# EAGLE schematic fabpdi-t90usb_v1.1 (EAGLE 8.2.2)
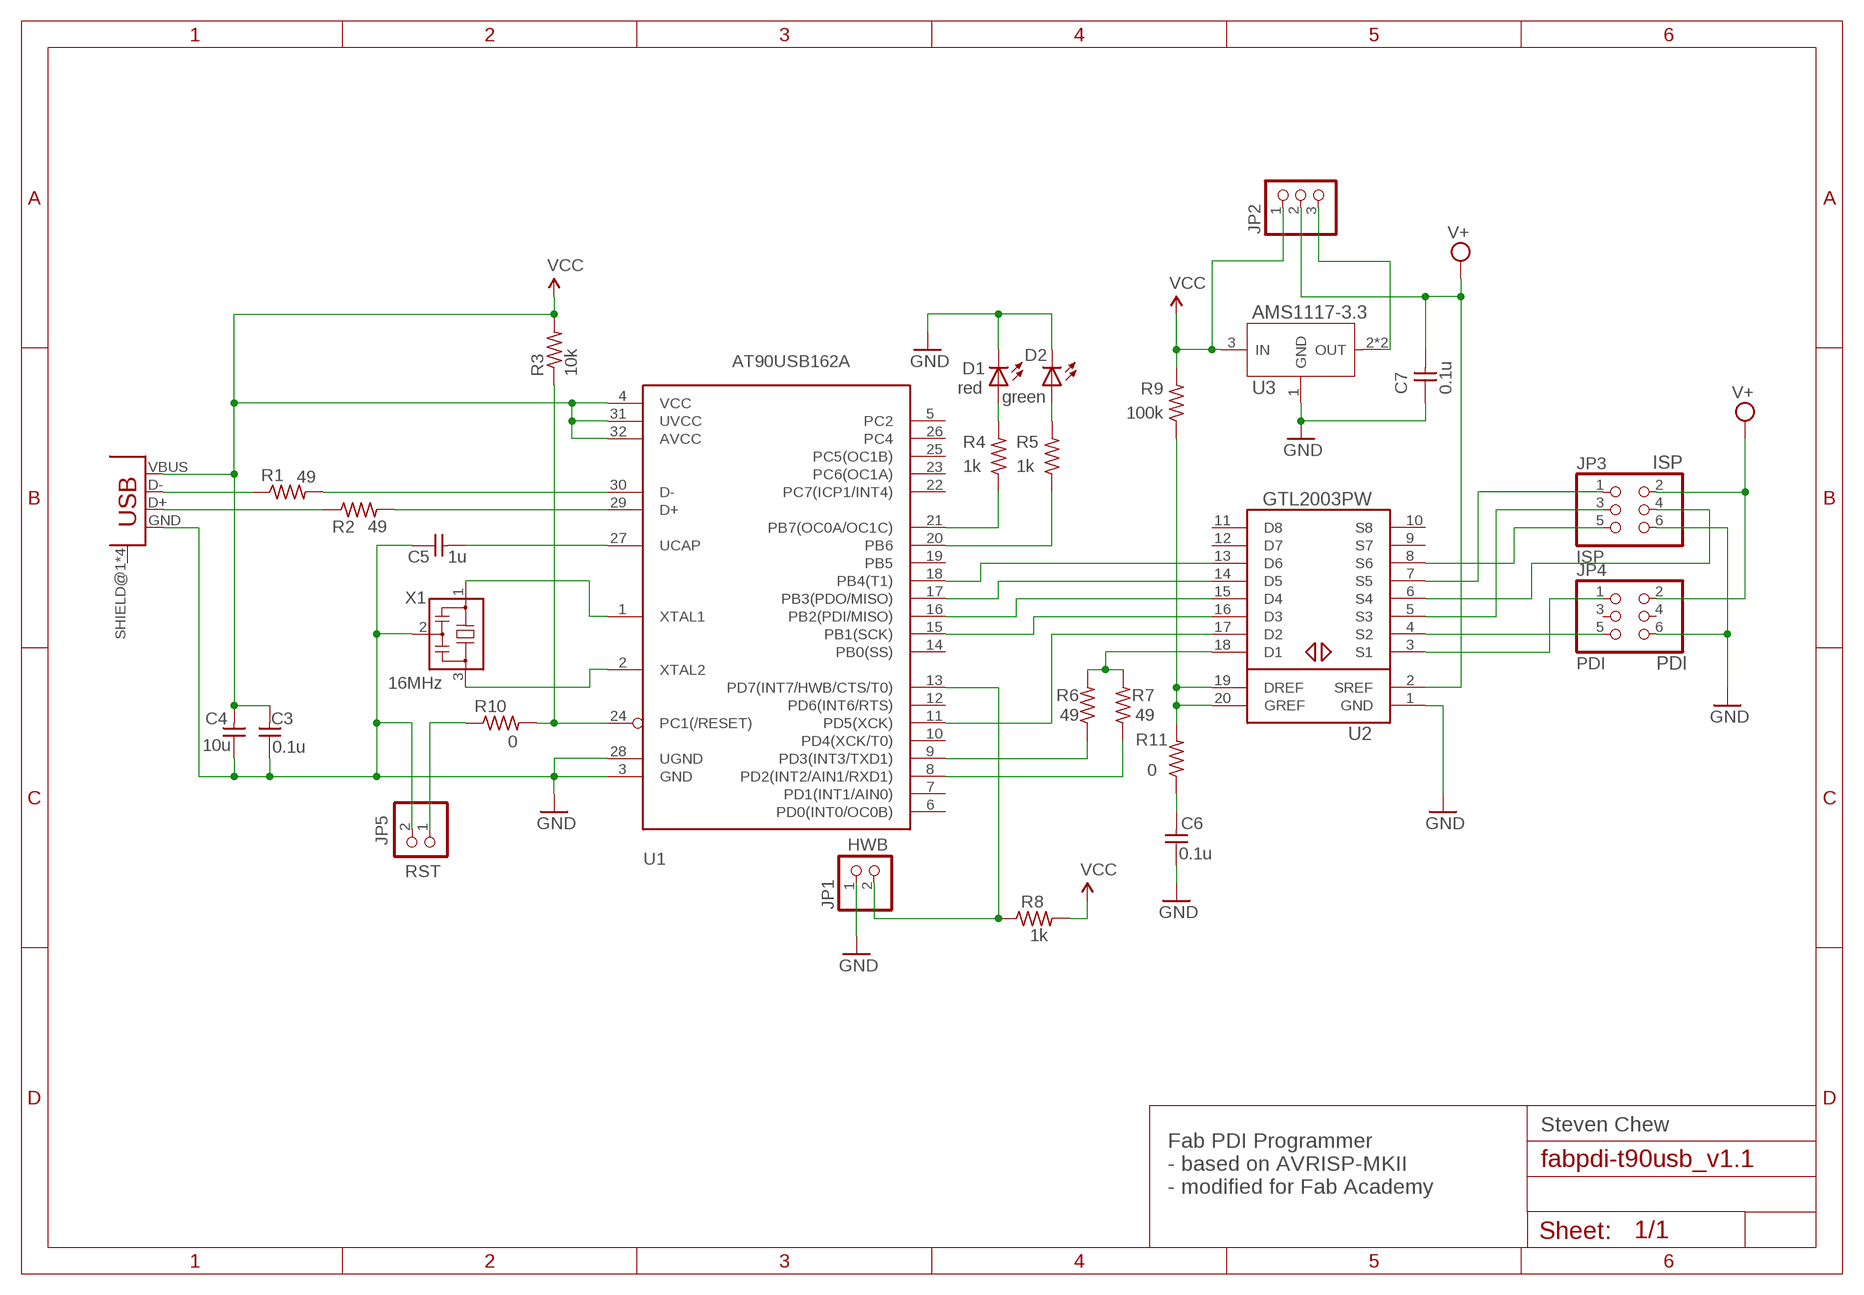
[diagram p0: schematic, sheet 1]

## Parts
C3  0.1u  CAP-UNPOLARIZEDFAB  [C1206FAB]
C4  10u  CAP-UNPOLARIZEDFAB  [C1206FAB]
C5  1u  CAP-UNPOLARIZEDFAB  [C1206FAB]
C6  0.1u  CAP-UNPOLARIZEDFAB  [C1206FAB]
C7  0.1u  CAP-UNPOLARIZEDFAB  [C1206FAB]
D1  red  LEDFAB1206  [LED1206FAB]
D2  green  LEDFAB1206  [LED1206FAB]
JP1  PINHD-1X2  [1X02]
JP2  PINHD-1X3  [1X03]
JP3  ISP  PINHD-2X3-SMDFAB  [2X03SMD-FAB]
JP4  PDI  PINHD-2X3-SMDFAB  [2X03SMD-FAB]
JP5  PINHD-1X2  [1X02]
R1  49  RES-US1206FAB  [R1206FAB]
R2  49  RES-US1206FAB  [R1206FAB]
R3  10k  RES-US1206FAB  [R1206FAB]
R4  1k  RES-US1206FAB  [R1206FAB]
R5  1k  RES-US1206FAB  [R1206FAB]
R6  49  RES-US1206FAB  [R1206FAB]
R7  49  RES-US1206FAB  [R1206FAB]
R8  1k  RES-US1206FAB  [R1206FAB]
R9  100k  RES-US1206FAB  [R1206FAB]
R10  0  RES-US1206FAB  [R1206FAB]
R11  0  RES-US1206FAB  [R1206FAB]
U1  AT90USB162A  [TQFP32-08]
U2  GTL2003PW  [TSSOP20]
U3  AMS1117-3.3  PMIC-CJT1117-3.3(SOT223)  [SOT-223]
U$1  USB_MINI  [USB_MINI]
X1  16MHz  RESONATOR  [EFOBM]

## Nets
GND: C3.1 C4.1 C5.1 C6.1 C7.1 D1.2(C) D2.2(C) JP1.1 JP3.6 JP4.6 JP5.2 U1.3(GND) U1.28(UGND) U2.1(GND) U3.1(GND) U$1.GND X1.2
N$1: R4.1 U1.21(PB7(OC0A/OC1C))
N$2: C5.2 U1.27(UCAP)
N$3: U1.1(XTAL1) X1.1
N$4: U1.2(XTAL2) X1.3
N$5: R2.1 U$1.D+
N$6: R2.2 U1.29(D+)
N$7: R1.1 U$1.D-
N$8: R1.2 U1.30(D-)
N$9: R3.1 R10.2 U1.24(PC1(/RESET))
N$10: R5.1 U1.20(PB6)
N$11: D1.1(A) R4.2
N$12: D2.1(A) R5.2
N$13: U1.11(PD5(XCK)) U2.17(D2)
N$14: R6.1 U1.9(PD3(INT3/TXD1))
N$15: R7.1 U1.8(PD2(INT2/AIN1/RXD1))
N$16: JP1.2 R8.1 U1.13(PD7(INT7/HWB/CTS/T0))
N$17: R6.2 R7.2 U2.18(D1)
N$18: U1.15(PB1(SCK)) U2.16(D3)
N$19: U1.16(PB2(PDI/MISO)) U2.15(D4)
N$20: U1.17(PB3(PDO/MISO)) U2.14(D5)
N$21: U1.18(PB4(T1)) U2.13(D6)
N$22: R9.1 R11.2 U2.19(DREF) U2.20(GREF)
N$23: JP3.1 U2.7(S5)
N$24: JP2.3 U3.2(OUT) U3.TER(OUT)
N$25: JP3.3 U2.5(S3)
N$26: JP3.4 U2.6(S4)
N$27: JP3.5 U2.8(S6)
N$28: JP4.5 U2.4(S2)
N$29: JP4.1 U2.3(S1)
N$30: C6.2 R11.1
N$31: JP5.1 R10.1
V+: C7.2 JP2.2 JP3.2 JP4.2 U2.2(SREF)
VCC: C3.2 C4.2 JP2.1 R3.2 R8.2 R9.2 U1.4(VCC) U1.31(UVCC) U1.32(AVCC) U3.3(IN) U$1.VBUS
Unconnected: JP4.3 JP4.4 U1.5(PC2) U1.6(PD0(INT0/OC0B)) U1.7(PD1(INT1/AIN0)) U1.10(PD4(XCK/T0)) U1.12(PD6(INT6/RTS)) U1.14(PB0(SS)) U1.19(PB5) U1.22(PC7(ICP1/INT4)) U1.23(PC6(OC1A)) U1.25(PC5(OC1B)) U1.26(PC4) U2.9(S7) U2.10(S8) U2.11(D8) U2.12(D7) U$1.SHIELD@1(SHIELD) U$1.SHIELD@2(SHIELD) U$1.SHIELD@3(SHIELD) U$1.SHIELD@4(SHIELD)

## Notes on the sheet
- ISP
- PDI
- HWB
- RST
- Steven Chew
- Fab PDI Programmer
  - based on AVRISP-MKII
  - modified for Fab Academy

## Library data of the parts
C3-C7 = 00fab:CAP-UNPOLARIZED
D1 D2 = 00fab:LED: LED
JP1 JP5 = pinhead:PINHD-1X2: PIN HEADER
JP2 = pinhead:PINHD-1X3: PIN HEADER
JP3 JP4 = 00fab:PINHD-2X3-SMD: PIN HEADER
R1-R11 = 00fab:RES-US: Resistor (US Symbol) Variants with postfix FAB are widened to allow the routing of internal traces
U1 = adafruit:AT90USB162: MICROCONTROLLER 8 Kbytes FLASH 1 kbytes SRAM 512 bytes EEPROM USART 6-channel 10 bit ADC 2-channel 8 bit ADC
U2 = gtl2003:GTL2003: 8-bit bidirectional low voltage translator
U3 = Seeed-IC:PMIC-CJT1117-3.3(SOT223): 310030097; MPN: CJT1117-3.3; VALUE: CJT1117-3.3-SOT223
U$1 = 00fab:USB_MINI
X1 = 00fab:RESONATOR